# EAGLE design LedPanel (EAGLE 8.0.1)
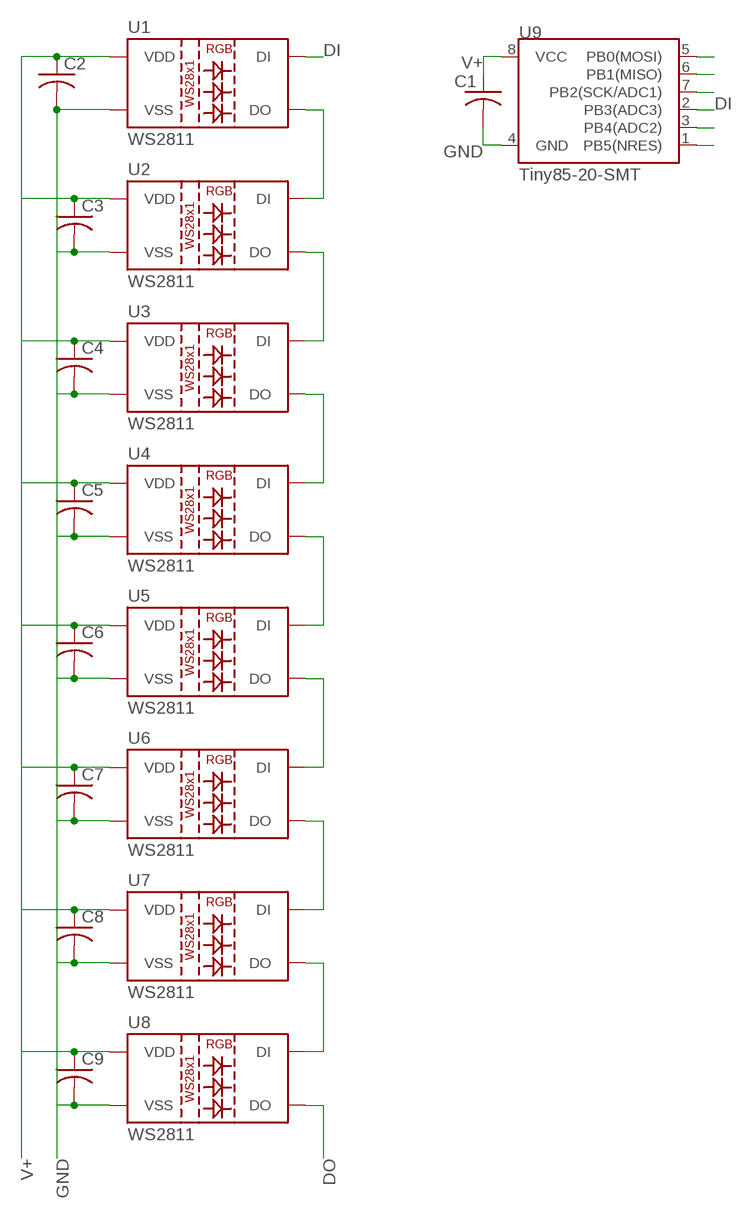
[diagram p0: schematic, sheet 1]

## Parts
C1  C-USC0805  [C0805]
C2  C-USC0805  [C0805]
C3  C-USC0805  [C0805]
C4  C-USC0805  [C0805]
C5  C-USC0805  [C0805]
C6  C-USC0805  [C0805]
C7  C-USC0805  [C0805]
C8  C-USC0805  [C0805]
C9  C-USC0805  [C0805]
U1  WS2811  LED-TRICOLOR-5050-ICWS2811  [LED-TRICOLOR-5050-IC]
U2  WS2811  LED-TRICOLOR-5050-ICWS2811  [LED-TRICOLOR-5050-IC]
U3  WS2811  LED-TRICOLOR-5050-ICWS2811  [LED-TRICOLOR-5050-IC]
U4  WS2811  LED-TRICOLOR-5050-ICWS2811  [LED-TRICOLOR-5050-IC]
U5  WS2811  LED-TRICOLOR-5050-ICWS2811  [LED-TRICOLOR-5050-IC]
U6  WS2811  LED-TRICOLOR-5050-ICWS2811  [LED-TRICOLOR-5050-IC]
U7  WS2811  LED-TRICOLOR-5050-ICWS2811  [LED-TRICOLOR-5050-IC]
U8  WS2811  LED-TRICOLOR-5050-ICWS2811  [LED-TRICOLOR-5050-IC]
U9  Tiny85-20-SMT  ATTINY45TINY85-20-SMT  [SO08-EIAJ]

## Nets
DI: U1.2(DI) U9.2(PB3(ADC3))
DO: U8.1(DO)
GND: C1.2 C2.2 C3.2 C4.2 C5.2 C6.2 C7.2 C8.2 C9.2 U1.6(VSS) U2.6(VSS) U3.6(VSS) U4.6(VSS) U5.6(VSS) U6.6(VSS) U7.6(VSS) U8.6(VSS) U9.4(GND)
N$1: U1.1(DO) U2.2(DI)
N$2: U2.1(DO) U3.2(DI)
N$3: U3.1(DO) U4.2(DI)
N$4: U4.1(DO) U5.2(DI)
N$5: U5.1(DO) U6.2(DI)
N$6: U6.1(DO) U7.2(DI)
N$7: U7.1(DO) U8.2(DI)
N$9: U9.3(PB4(ADC2))
N$10: U9.7(PB2(SCK/ADC1))
N$11: U9.6(PB1(MISO))
N$12: U9.5(PB0(MOSI))
N$13: U9.1(PB5(NRES))
V+: C1.1 C2.1 C3.1 C4.1 C5.1 C6.1 C7.1 C8.1 C9.1 U1.3(VDD) U1.5(VDD) U2.3(VDD) U2.5(VDD) U3.3(VDD) U3.5(VDD) U4.3(VDD) U4.5(VDD) U5.3(VDD) U5.5(VDD) U6.3(VDD) U6.5(VDD) U7.3(VDD) U7.5(VDD) U8.3(VDD) U8.5(VDD) U9.8(VCC)

## Library data of the parts
C1-C9 = resistor:C-US: CAPACITOR, American symbol
U1-U8 = SparkFun-LED:LED-TRICOLOR-5050-IC: WS2812 RGB LED w/ WS2811 driver 5x5mm SMD LED with built-in controller IC. DIO-11598; PROD_ID: DIO-11598
U9 = SparkFun-DigitalIC:ATTINY45: Atmel 8-pin 2/4/8kB flash uC; PROD_ID: IC-09092

## Board
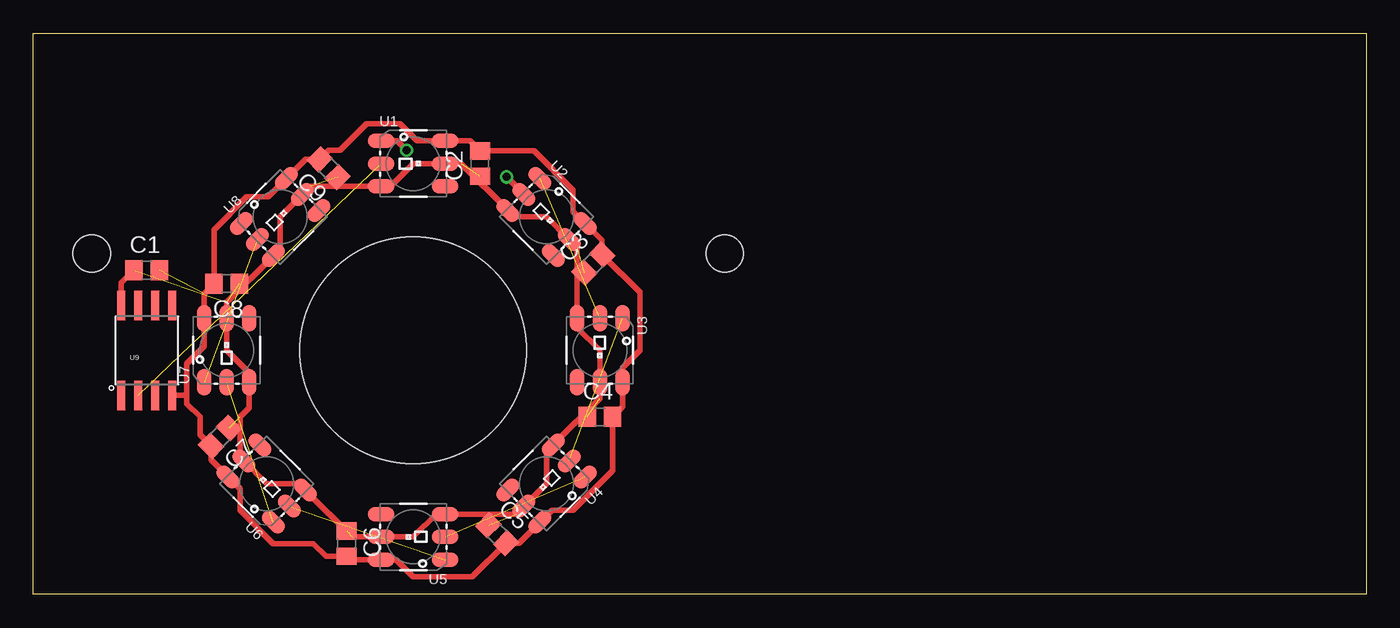
[diagram p1: board, top side]
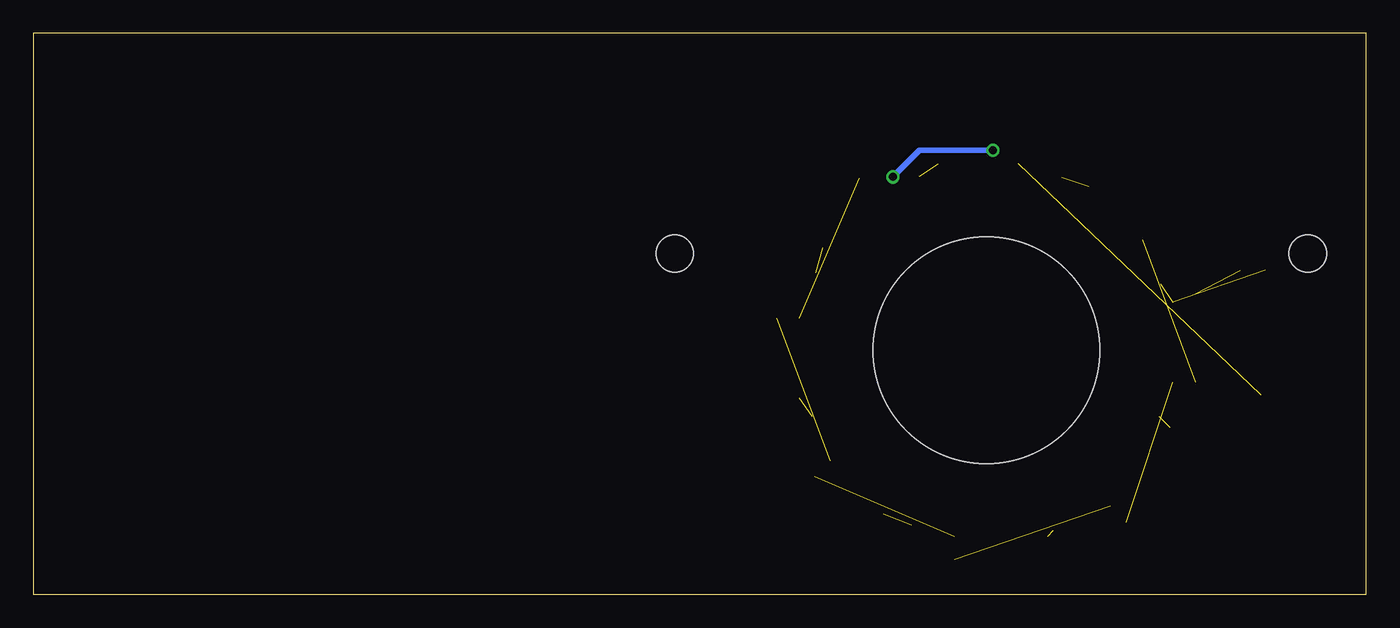
[diagram p2: board, bottom side, seen from below]

Size 100.01 x 42.07 mm. Coordinates in mm from the lower left corner, seen from the top.
Outline: 0,42.07 100,42.07 100.01,0 0.01,0 0,42.07
Copper layers (1*16): Top 0.035mm / dielectric 1.5mm / Bottom 0.035mm
Design rules "default": minimum track width 10mil, minimum drill 24mil, track to track 8mil, track to pad 8mil, pad to pad 8mil, via to via 8mil, smd to smd 8mil, copper to edge 40mil, drill to drill 8mil, minimum pad ring 10mil, minimum via ring 8mil, stop-mask expansion 4mil, vias tented up to drill 0mil, thermal gap 10mil
Holes 2.8 mm at 4.38,25.55 51.88,25.55
Holes 17 mm at 28.51,18.3

### Footprints (pad centres in the part's own frame; a part is rotated, then mirrored left to right if it is on the bottom)
C0805 = smd 1.3 x 1.5: 1 -0.95,0; 2 0.95,0
LED-TRICOLOR-5050-IC = smd 2 x 1.1: 1 -2.4,1.7; 2 -2.4,0; 3 -2.4,-1.7; 4 2.4,-1.7; 5 2.4,0; 6 2.4,1.7
SO08-EIAJ = smd 0.61 x 2.21: 1 -1.905,-3.378; 2 -0.635,-3.378; 3 0.635,-3.378; 4 1.905,-3.378; 5 1.905,3.353; 6 0.635,3.353; 7 -0.635,3.353; 8 -1.905,3.353

### Placement (x,y rotation side)
C1  8.51,24.3 0 top
C2  33.51,32.3 90 top
C3  42.01,24.8 45 top
C4  42.51,13.3 0 top
C5  34.8,4.51 315 top
C6  23.51,3.8 270 top
C7  14.01,11.8 225 top
C8  14.51,23.3 180 top
C9  22.16,31.95 135 top
U1  28.51,32.3 0 top
U2  38.51,28.3 315 top
U3  42.51,18.3 270 top
U4  38.51,8.3 225 top
U5  28.51,4.3 180 top
U6  17.51,8.3 135 top
U7  14.51,18.3 90 top
U8  18.51,28.3 45 top
U9  8.51,18.3 0 top

### Tracks (layer width: path | path; a pad name or v marks a point on that pad's centre or on a via)
DI  (1 unrouted)
GND  (1 unrouted)
  Top 0.406: 11.51,14.8 11.51,14.3 12.51,13.3 12.51,11.96 C7.2 13.34,10.07 U6.6 15.51,7.9 15.51,6.3 18.01,3.8 21.01,3.8 21.96,2.85 C6.2 23.76,2.6 U5.6 27.21,2.6 28.51,1.3 32.94,1.3 C5.2 36.45,3.84 U4.6 38.91,6.3 40.51,6.3 43.46,9.25 C4.2 44.21,14.05 U3.6 44.21,17 45.51,18.3 45.51,22.64 C3.2 42.68,26.53 U2.6 40.51,28.7 40.51,30.3 37.56,33.25 C2.2 32.76,34 U1.6 28.81,34 27.51,35.3 25.01,35.3 23.01,33.3 22.17,33.3 C9.2 20.42,32.62 U8.6 17.61,29.8 16.01,29.8 13.56,27.35 C8.2 12.81,22.55 U7.6 12.81,18.6 11.51,17.3 11.51,14.8 | U9.4 11.39,14.92 11.51,14.8
N$1  (via drill 0.6)
  Top 0.406: U1.1 27.31,34 v28.01,33.3 | U2.2 | U2.2 v35.51,31.3
  Bottom 0.406: v28.01,33.3 33.51,33.3 v35.51,31.3
N$2  (1 unrouted)
N$3  (1 unrouted)
N$4  (1 unrouted)
N$5  (1 unrouted)
N$6  (1 unrouted)
N$7  (1 unrouted)
V+  (9 unrouted)
  Top 0.406: U2.5 40.81,26 U3.3 40.81,20 42.51,18.3 U3.5 42.51,14.7 U4.3 38.51,10.7 38.51,8.3 U4.5 36.21,6 U5.3 30.21,6 28.51,4.3 U5.5 23.91,4.3 U6.3 19.91,8.3 17.51,8.3 U6.5 | U6.5 15.51,10.3 15.51,13.3 16.21,14 U7.3 16.21,16.6 14.51,18.3 U7.5 14.51,21.9 U8.3 18.51,25.9 18.51,28.3 U8.5 20.81,30.6 U1.3 26.81,30.6 28.51,32.3 U1.5 32.11,32.3 U2.3 36.11,28.3 38.51,28.3 U2.5 | U9.8 6.61,23.35 C1.1 | U2.5 | U6.5